# Altium schematic sheet MCU Board.SchDoc
size A; SheetNumber: 6; SheetTotal: 7
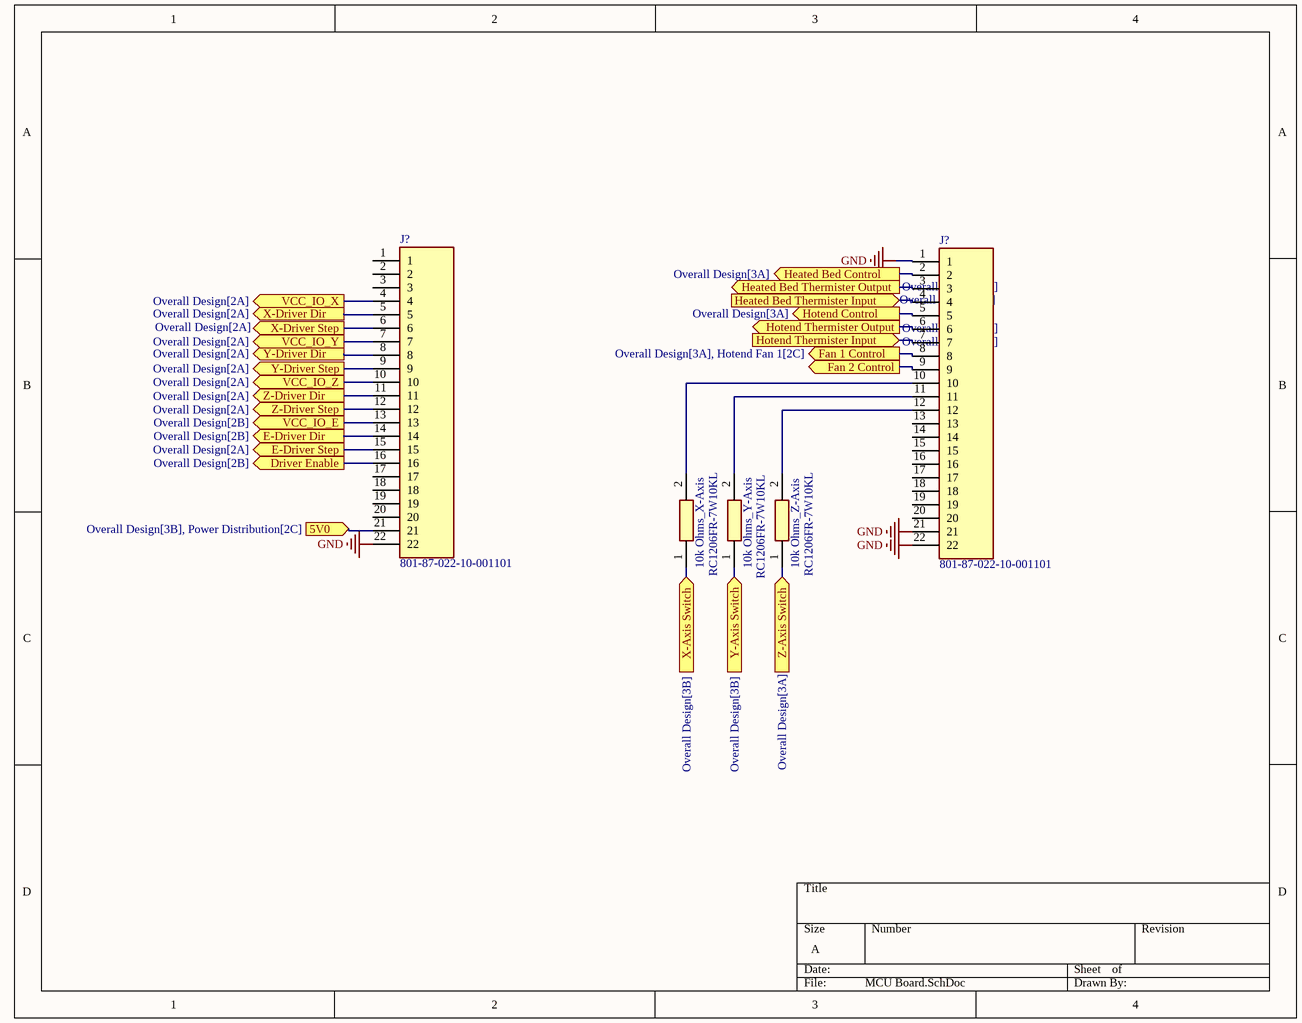
[diagram p0: MCU Board.SchDoc]

## Parts
(Parts that share a designator on the sheet are numbered #1, #2 ... from top to bottom, then left to right.)
10k_Ohms_X-Axis  RC1206FR-7W10KL  [RESC3116X65N]
10k_Ohms_Y-Axis  RC1206FR-7W10KL  [RESC3116X65N]
10k_Ohms_Z-Axis  RC1206FR-7W10KL  [RESC3116X65N]
J?#1  801-87-022-10-001101  [RHDR22W60P0X254_1X22_5588X254X700P]
J?#2  801-87-022-10-001101  [RHDR22W60P0X254_1X22_5588X254X700P]

## Ports
5V0 (in, see Overall Design[3B], Power Distribution[2C]), Driver Enable (out, see Overall Design[2B]), E-Driver Dir (out, see Overall Design[2B]), E-Driver Step (out, see Overall Design[2A]), Fan 1 Control (out, see Overall Design[3A], Hotend Fan 1[2C]), Fan 2 Control (out), Heated Bed Control (out, see Overall Design[3A]), Heated Bed Thermister Input (in, see Overall Design[3A]), Heated Bed Thermister Output (out, see Overall Design[3A]), Hotend Control (out, see Overall Design[3A]), Hotend Thermister Input (in, see Overall Design[3A]), Hotend Thermister Output (out, see Overall Design[3A]), VCC_IO_E (out, see Overall Design[2B]), VCC_IO_X (out, see Overall Design[2A]), VCC_IO_Y (out, see Overall Design[2A]), VCC_IO_Z (out, see Overall Design[2A]), X-Axis Switch (in, see Overall Design[3B]), X-Driver Dir (out, see Overall Design[2A]), X-Driver Step (out, see Overall Design[2A]), Y-Axis Switch (in, see Overall Design[3B]), Y-Driver Dir (out, see Overall Design[2A]), Y-Driver Step (out, see Overall Design[2A]), Z-Axis Switch (in, see Overall Design[3A]), Z-Driver Dir (out, see Overall Design[2A]), Z-Driver Step (out, see Overall Design[2A])

## Nets
GND: J?#1.22 J?#2.1 J?#2.21 J?#2.22
5V0: J?#1.21 ; port 5V0
Driver Enable: J?#1.16 ; port Driver Enable
E-Driver Dir: J?#1.14 ; port E-Driver Dir
E-Driver Step: J?#1.15 ; port E-Driver Step
Fan 1 Control: J?#2.8 ; port Fan 1 Control
Fan 2 Control: J?#2.9 ; port Fan 2 Control
Heated Bed Control: J?#2.2 ; port Heated Bed Control
Heated Bed Thermister Input: J?#2.4 ; port Heated Bed Thermister Input
Heated Bed Thermister Output: J?#2.3 ; port Heated Bed Thermister Output
Hotend Control: J?#2.5 ; port Hotend Control
Hotend Thermister Input: J?#2.7 ; port Hotend Thermister Input
Hotend Thermister Output: J?#2.6 ; port Hotend Thermister Output
VCC_IO_E: J?#1.13 ; port VCC_IO_E
VCC_IO_X: J?#1.4 ; port VCC_IO_X
VCC_IO_Y: J?#1.7 ; port VCC_IO_Y
VCC_IO_Z: J?#1.10 ; port VCC_IO_Z
X-Axis Switch: 10k_Ohms_X-Axis.1 ; port X-Axis Switch
X-Driver Dir: J?#1.5 ; port X-Driver Dir
X-Driver Step: J?#1.6 ; port X-Driver Step
Y-Axis Switch: 10k_Ohms_Y-Axis.1 ; port Y-Axis Switch
Y-Driver Dir: J?#1.8 ; port Y-Driver Dir
Y-Driver Step: J?#1.9 ; port Y-Driver Step
Z-Axis Switch: 10k_Ohms_Z-Axis.1 ; port Z-Axis Switch
Z-Driver Dir: J?#1.11 ; port Z-Driver Dir
Z-Driver Step: J?#1.12 ; port Z-Driver Step
Net10k_Ohms_X-Axis_2: 10k_Ohms_X-Axis.2 J?#2.10
Net10k_Ohms_Y-Axis_2: 10k_Ohms_Y-Axis.2 J?#2.11
Net10k_Ohms_Z-Axis_2: 10k_Ohms_Z-Axis.2 J?#2.12

Not connected (* = marked no-connect by the designer): J?#1 1 2 3 17 18 19 20; J?#2 13 14 15 16 17 18 19 20

## Library data of the parts
10k_Ohms_X-Axis 10k_Ohms_Y-Axis 10k_Ohms_Z-Axis = RC1206FR-7W10KL: Resistor; Manufacturer_Name: KEMET; Datasheet Link: https://datasheet.datasheetarchive.com/originals/distributors/Datasheets_SAMA/902f9e387b938f871d31120f5fc1d65e.pdf; Height: 0.65mm; Manufacturer_Part_Number: RC1206FR-7W10KL; Arrow Part Number: RC1206FR-7W10KL; Arrow Price/Stock: https://www.arrow.com/en/products/rc1206fr-7w10kl/yageo
J?#1 J?#2 = 801-87-022-10-001101: Connector; Manufacturer_Name: Preci-Dip; Datasheet Link: https://www.precidip.com/pview/801-PP-NNN-10-001101.html; Height: 7mm; Manufacturer_Part_Number: 801-87-022-10-001101